# Altium schematic sheet DRIVER4.SchDoc
size A; SheetNumber: 14; SheetTotal: 14
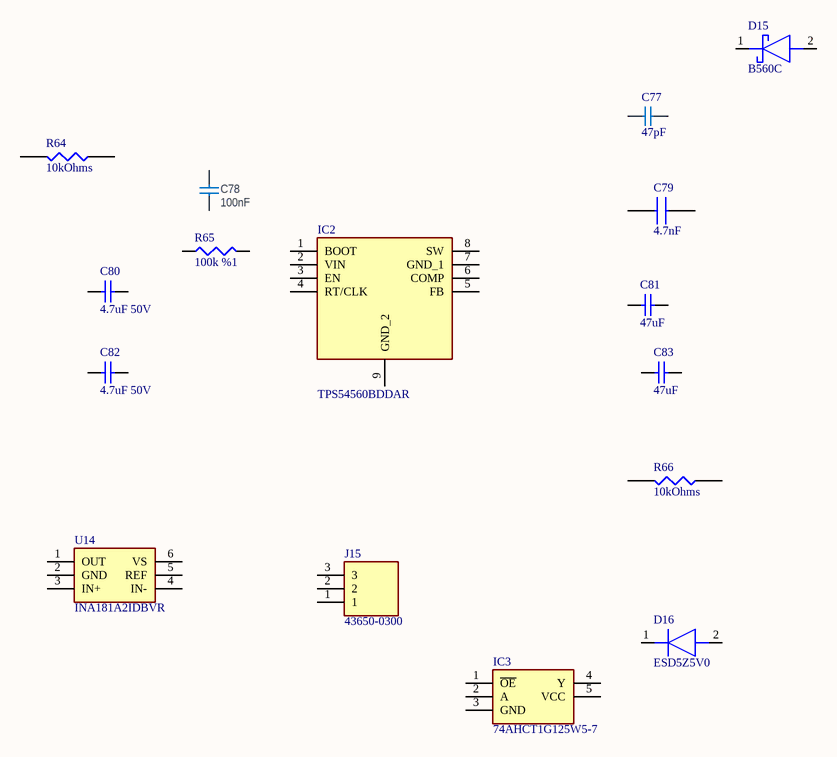
[diagram p0: DRIVER4.SchDoc]

## Parts
C77  47pF  [CAPC1608X100N]
C78  100nF  [CAPC0603X03L_C]
C79  4.7nF  [CAP0805]
C80  value 4.7uF 50V  [SMC0805]  (hidden comment: CAP CER 4.7UF 50V X5R 0805)
C81  47uF  [0805_C]
C82  value 4.7uF 50V  [SMC0805]  (hidden comment: CAP CER 4.7UF 50V X5R 0805)
C83  47uF  [0805_C]
D15  B560C  [DIOM7959X250N]
D16  ESD5Z5V0  [SODFL1608X70N]
IC2  TPS54560BDDAR  [SOIC127P600X170-9N]
IC3  74AHCT1G125W5-7  [SOT95P285X140-5N]
J15  43650-0300  [436500300]
R64  10kOhms  [RESC0603X03L_C]
R65  100k %1  [RESIS_0603]
R66  10kOhms  [RESC0603X03L_C]
U14  INA181A2IDBVR  [SOT95P280X145-6N]

## Nets

Not connected (* = marked no-connect by the designer): C77 1 2; C78 1 2; C79 1 2; C80 1 2; C81 1 2; C82 1 2; C83 1 2; D15 1(K) 2(A); D16 1(K) 2(A); IC2 1(BOOT) 2(VIN) 3(EN) 4(RT/CLK) 5(FB) 6(COMP) 7(GND_1) 8(SW) 9(GND_2); IC3 1(~{OE}) 2(A) 3(GND) 4(Y) 5(VCC); J15 1 2 3; R64 1 2; R65 1 2; R66 1 2; U14 1(OUT) 2(GND) 3(IN+) 4(IN-) 5(REF) 6(VS)

## Library data of the parts
C77 = GMC10CG470F200NT: 47 pF ±1% 200V Ceramic Capacitor C0G, NP0 0603 (1608 Metric); Manufacturer: Cal-Chip Electronics, Inc.; MPN: GMC10CG470F200NT; Supplier: 4713-GMC10CG470F200NTDKR-ND
C78 = C0201-100n-25V-X5R: Capacitor, Ceramic, X5R, ±10%, 25V; Manufacturer: Murata; Manufacturer Part Number: GRM033R61E104KE14J; Part number NEMS: 100200459; Artikkelnr Noca: N.A.; Pad Count: 2; Component Status: Active; Part Number: C0201-100n-25V-X5R; LatestRevisionDate: 2020-12-16; Published: 2020-12-16; Value: 100nF; Note: 25V; Footprint Doc: 0201; Part number IPS: N.A.; ComponentLink1URL: https://search.murata.co.jp/Ceramy/image/img/A01X/G101/ENG/GRM033R61E104KE14-01.pdf; ComponentLink1Description: Datasheet; ComponentLink2URL: https://www.murata.com/en-global/products/productdetail?partno=GRM033R61E104KE14%23; ComponentLink2Description: Supplier link; HelpURL: N.A.; Supplier 1: Digi-Key; Supplier Part Number 1: 490-14571-1-ND; Supplier 2: Mouser; Supplier Part Number 2: 81-GRM033R61E104KE4J; Component Class: Capacitors; PartId: 100200459; Author: rsk; Part number Norautron: N.A.
C79 = CAP0805_4.7nF_1kV: 4700 pF ±10% 1000V (1kV) Ceramic Capacitor X7R 0805 (2012 Metric); Manufacturer_Name: Samsung Electro-Mechanics; Manufacturer Part Number: C0805C472KDRAC7800; Value: 4.7nF 1kV; Datasheet Link: https://www.yageo.com/upload/media/product/productsearch/datasheet/mlcc/UPY-GPHC_X5R_4V-to-50V_27.pdf; Height: 1.45mm; Mouser Price/Stock: https://www.mouser.co.uk/ProductDetail/YAGEO/CC0805KKX5R8BB106?qs=57cj7OiSijm89pM64t1AGQ%3D%3D
C80 C82 = CAP0805_4.7UF_50V: 4.7 µF ±10% 50V Ceramic Capacitor X5R 0805 (2012 Metric); Manufacturer Part Number: GRT21BR61H475KE13L; Order Code: DIGI: 490-12394-2-ND
C81 C83 = Cap_1_3: CAP CER 47UF 10V X5R 0805; Manufacturer: Murata Electronics North America; Manufacturer Part Number: GRM21BR61A476ME15K; Value: 47uF; Supplier Part Number: 490-GRM21BR61A476ME15KCT-ND
D15 = B560C: Schottky Diode; Manufacturer_Name: Lite-On; Datasheet Link: https://datasheet.datasheetarchive.com/originals/distributors/Datasheets-17/DSA-323419.pdf; Height: 2.5mm; Manufacturer_Part_Number: B560C; Arrow Part Number: B560C; Arrow Price/Stock: https://www.arrow.com/en/products/b560c/lite-on-technology.html?utm_currency=USD&region=nac
D16 = ESD5Z5V0: Diode; Manufacturer_Name: Diotec; Datasheet Link: https://www.mouser.in/datasheet/2/849/esd5z2v5-2891948.pdf; Height: 0.7mm; Manufacturer_Part_Number: ESD5Z5V0; Mouser Part Number: 637-ESD5Z5V0; Mouser Price/Stock: https://www.mouser.co.uk/ProductDetail/Diotec-Semiconductor/ESD5Z5V0?qs=OlC7AqGiEDkOteFEVl3upQ%3D%3D; Arrow Part Number: ESD5Z5V0; Arrow Price/Stock: https://www.arrow.com/en/products/esd5z5v0/diotec-semiconductor-ag?utm_currency=USD&region=nac
IC2 = TPS54560BDDAR: Integrated Circuit; Manufacturer_Name: Texas Instruments; Datasheet Link: http://www.ti.com/lit/gpn/TPS54560B; Height: 1.7mm; Manufacturer_Part_Number: TPS54560BDDAR; Mouser Part Number: 595-TPS54560BDDAR; Mouser Price/Stock: https://www.mouser.co.uk/ProductDetail/Texas-Instruments/TPS54560BDDAR?qs=gZXFycFWdAMPyxqrm5VZeg%3D%3D; Arrow Part Number: TPS54560BDDAR; Arrow Price/Stock: https://www.arrow.com/en/products/tps54560bddar/texas-instruments.html?utm_currency=USD&region=nac
IC3 = 74AHCT1G125W5-7: Integrated Circuit; Manufacturer_Name: Diodes Incorporated; Datasheet Link: https://www.diodes.com//assets/Datasheets/74AHCT1G125.pdf; Height: 1.4mm; Manufacturer_Part_Number: 74AHCT1G125W5-7; Mouser Part Number: 621-74AHCT1G125W5-7; Mouser Price/Stock: https://www.mouser.co.uk/ProductDetail/Diodes-Incorporated/74AHCT1G125W5-7?qs=MKoP7Oyr0W7vMAMo33ehAw%3D%3D; Arrow Part Number: 74AHCT1G125W5-7; Arrow Price/Stock: https://www.arrow.com/en/products/74ahct1g125w5-7/diodes-incorporated.html?utm_currency=USD&region=nac
J15 = 43650-0300: Connector; Manufacturer_Name: Molex; Datasheet Link: https://www.molex.com/pdm_docs/sd/436500200_sd.pdf; Height: 13.56mm; Manufacturer_Part_Number: 43650-0300; Mouser Part Number: 538-43650-0300; Mouser Price/Stock: https://www.mouser.co.uk/ProductDetail/Molex/43650-0300?qs=P7cO%252B%252BFDLzTpuYfoYulxAA%3D%3D; Arrow Part Number: 43650-0300; Arrow Price/Stock: https://www.arrow.com/en/products/43650-0300/molex?region=nac
R64 R66 = TNPW060310K0FHTA: 10 kOhms ±1% 0.1W, 1/10W Chip Resistor 0603 (1608 Metric) Automotive AEC-Q200 Thin Film; Manufacturer: Vishay Dale; Supplier: Digi; 541-3906-6-ND
R65 = 0603WAF1003T5E: -55℃~+155℃ 100kΩ 100mW 75V Thick Film Resistor ±1% ±100ppm/℃ 0603 Chip Resistor - Surface Mount ROHS; Manufacturer: UNI-ROYAL(Uniroyal Elec); Supplier_JLCPCB: C25803; Supplier_MOUSER: 303-0603WAF1003T5E
U14 = INA181A2IDBVR: Undefined or Miscellaneous; Manufacturer_Name: Texas Instruments; Datasheet Link: http://www.ti.com/general/docs/suppproductinfo.tsp?distId=26&gotoUrl=http%3A%2F%2Fwww.ti.com%2Flit%2Fgpn%2Fina181; Height: 1.45mm; Manufacturer_Part_Number: INA181A2IDBVR; Mouser Part Number: 595-INA181A2IDBVR; Mouser Price/Stock: https://www.mouser.co.uk/ProductDetail/Texas-Instruments/INA181A2IDBVR?qs=5aG0NVq1C4wvxWxbAGEmKw%3D%3D; Arrow Part Number: INA181A2IDBVR; Arrow Price/Stock: https://www.arrow.com/en/products/ina181a2idbvr/texas-instruments.html?utm_currency=USD&region=nac